# Altium schematic sheet Connectors.SchDoc
size A4; DocumentNumber: 1; SheetNumber: 1; SheetTotal: 8
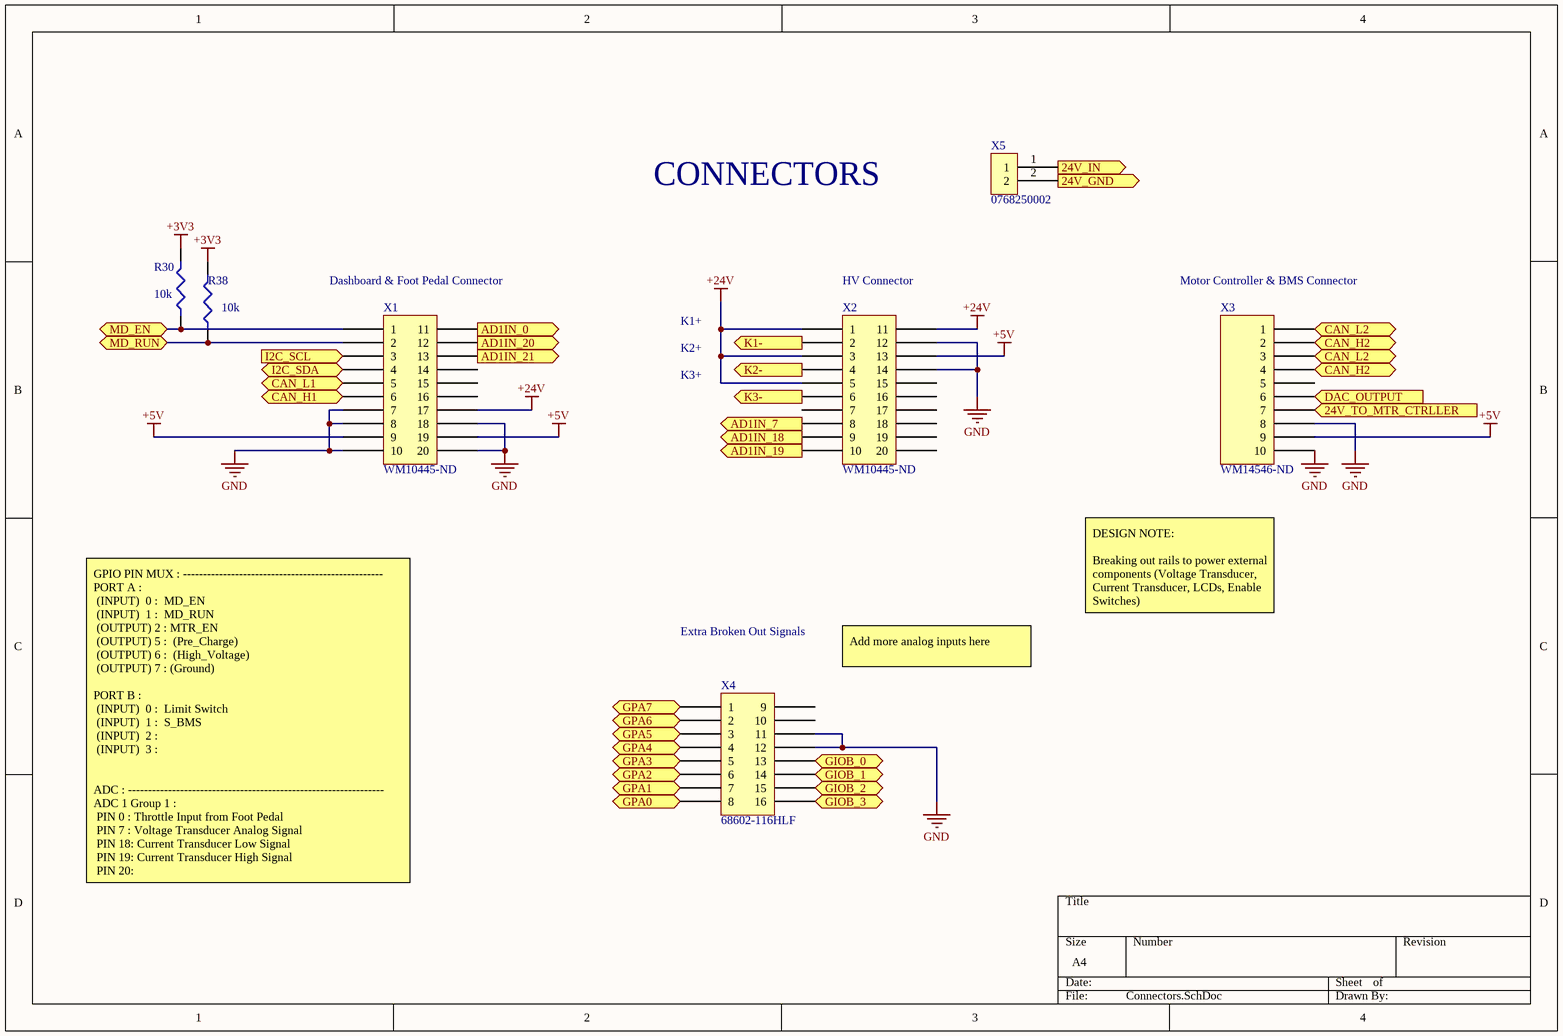
[diagram p0: Connectors.SchDoc]

## Parts
R30  10k  [R0805]
R38  10k  [R0805]
X1  WM10445-ND  [MOLEX_20pin]
X2  WM10445-ND  [MOLEX_20pin]
X3  WM14546-ND  [MOLEX_10PIN]
X4  68602-116HLF  [16PIN_HEADER]
X5  0768250002  [MOLEX_2PIN_MEGAFIT]

## Ports
24V_GND, 24V_IN, 24V_TO_MTR_CTRLLER, AD1IN_0, AD1IN_7, AD1IN_18, AD1IN_19, AD1IN_20, AD1IN_21, CAN_H1, CAN_H2, CAN_L1, CAN_L2, DAC_OUTPUT, GIOB_0, GIOB_1, GIOB_2, GIOB_3, GPA0, GPA1, GPA2, GPA3, GPA4, GPA5, GPA6, GPA7, I2C_SCL, I2C_SDA, K1-, K2-, K3-, MD_EN, MD_RUN

## Nets
+3V3: R30.2 R38.2
+5V: X1.9 X1.19 X2.13 X3.9
+24V: X1.17 X2.1 X2.3 X2.5 X2.11
GND: X1.7 X1.8 X1.10 X1.18 X1.20 X2.12 X2.14 X3.8 X3.10 X4.11 X4.12
24V_GND: X5.2 ; port 24V_GND
24V_IN: X5.1 ; port 24V_IN
24V_TO_MTR_CTRLLER: X3.7 ; port 24V_TO_MTR_CTRLLER
AD1IN_0: X1.11 ; port AD1IN_0
AD1IN_7: X2.8 ; port AD1IN_7
AD1IN_18: X2.9 ; port AD1IN_18
AD1IN_19: X2.10 ; port AD1IN_19
AD1IN_20: X1.12 ; port AD1IN_20
AD1IN_21: X1.13 ; port AD1IN_21
CAN_H1: X1.6 ; port CAN_H1
CAN_H2: X3.2 X3.4 ; port CAN_H2
CAN_L1: X1.5 ; port CAN_L1
CAN_L2: X3.1 X3.3 ; port CAN_L2
DAC_OUTPUT: X3.6 ; port DAC_OUTPUT
GIOB_0: X4.13 ; port GIOB_0
GIOB_1: X4.14 ; port GIOB_1
GIOB_2: X4.15 ; port GIOB_2
GIOB_3: X4.16 ; port GIOB_3
GPA0: X4.8 ; port GPA0
GPA1: X4.7 ; port GPA1
GPA2: X4.6 ; port GPA2
GPA3: X4.5 ; port GPA3
GPA4: X4.4 ; port GPA4
GPA5: X4.3 ; port GPA5
GPA6: X4.2 ; port GPA6
GPA7: X4.1 ; port GPA7
I2C_SCL: X1.3 ; port I2C_SCL
I2C_SDA: X1.4 ; port I2C_SDA
K1-: X2.2 ; port K1-
K2-: X2.4 ; port K2-
K3-: X2.6 ; port K3-
MD_EN: R30.1 X1.1 ; port MD_EN
MD_RUN: R38.1 X1.2 ; port MD_RUN

Not connected (* = marked no-connect by the designer): X1 14 15 16; X2 7 15 16 17 18 19 20; X3 5; X4 9 10

## Notes on the sheet
- CONNECTORS
- (near X1) Dashboard & Foot Pedal Connector
- (near X2) HV Connector
- (near X3) Motor Controller & BMS Connector
- K1+
- K2+
- K3+
- Extra Broken Out Signals
- DESIGN NOTE:
  Breaking out rails to power external components (Voltage Transducer, Current Transducer, LCDs, Enable Switches)
- Add more analog inputs here
- GPIO PIN MUX : --------------------------------------------------
  PORT A :
  (INPUT)		0 : 	MD_EN
  (INPUT)		1 : 	MD_RUN
  (OUTPUT)	2 :	MTR_EN
  (OUTPUT)	5 : 	(Pre_Charge)
  (OUTPUT)	6 : 	(High_Voltage)
  (OUTPUT)	7 :	(Ground)
  PORT B :
  (INPUT)		0 : 	Limit Switch
  (INPUT)		1 : 	S_BMS
  (INPUT)		2 :
  (INPUT)		3 :
  ADC : ----------------------------------------------------------------
  ADC 1 Group 1 :
  PIN 0 : Throttle Input from Foot Pedal
  PIN 7 : Voltage Transducer Analog Signal
  PIN 18: Current Transducer Low Signal
  PIN 19: Current Transducer High Signal
  PIN 20:

## Library data of the parts
R30 R38 = RC0805FR-071KL: RES SMD 10K OHM 1% 1/8W 0805; Manufacturer: Yageo Phycomp; Temperature Coefficient: 100ppm/°C; Resistance: 1KR; Voltage Rating (DC): 150V; Power Rating: 125mW; Supplier 1: Digi-Key; Manufacturer Part Number: RC0805FR-071KL; Stock 1: 5527973; Pricing 1: 1=0.1, 10=0.022, 100=0.0088, 1000=0.004, 2500=0.0034 (USD); Case/Package: 0805; Number of Pins: 2; Min Operating Temperature: -55°C; Max Operating Temperature: 155°C; Tolerance: 1%; Packaging: Cut Tape; Length: 2mm; Height: 0.5mm; Width: 1.25mm; Depth: 1.25mm; REACH SVHC: No SVHC; Lead Free: Lead Free
X1 X2 = 0346916200: CONN_20Positions Molex Stac64 Header, Shrouded Connector 0.100" (2.54mm) Through Hole, Right Angle Tin; Number of Positions: 20; Connector Type: Male Pin; Pitch: 0.1inch; Supplier 1: Digi-Key; Manufacturer: Molex; Manufacturer Part Number: 0346916200; Stock 1: 334; Pricing 1: 1=3.07, 10=2.946, 100=2.4546, 500=2.0864, 1000=1.7796, 5000=1.5955 (USD); Case/Package: 100; Colour: Black; Contact Plating: Tin; Package Quantity: 560; Packaging: Tray; Number of Rows: 2; Termination: Solder; Row Spacing: 0.1inch; ComponentLink1URL: https://datasheet.ciiva.com/29142/987651-0141-29142848.pdf; ComponentLink1Description: https://datasheet.ciiva.com/29142/987651-0141-29142848.pdf; Supplier Part Number 1: WM10445-ND
X3 = 0346960101: CONN_10Positions Molex Stac64 Thru-Hole Tray; Number of Positions: 10; Gender: Male; Connector Type: Male Pin; Row Spacing: 0.248inch; Pitch: 2.54mm; Supplier 1: Digi-Key; Manufacturer: Molex; Manufacturer Part Number: 0346960101; Stock 1: 1144; Pricing 1: 1=2.65, 10=2.54, 100=2.1164, 500=1.7989, 1000=1.5344, 5000=1.3757 (USD); Mount: Through Hole; Colour: Grey; Contact Plating: Tin; Contact Material: Copper; Housing Colour: Natural; Housing Material: Thermoplastic; Min Operating Temperature: -40°C; Max Operating Temperature: 100°C; Package Quantity: 560; Number of Rows: 2; Fastening Type: Latch; Packaging: Tray; Termination: Solder; Number of Contacts: 10; Orientation: Right Angle; Length: 34.04mm; ComponentLink1URL: https://datasheet.ciiva.com/6844/346960101-sd-6844161.pdf; ComponentLink1Description: https://datasheet.ciiva.com/6844/346960101-sd-6844161.pdf; ComponentLink2URL: https://datasheet.ciiva.com/10081/0346960101-pcb-headers-10081642.pdf; ComponentLink2Description: https://datasheet.ciiva.com/10081/0346960101-pcb-headers-10081642.pdf; Supplier Part Number 1: WM14546-ND
X4 = 68602-116HLF: CONN_HeaderPins16pos1  6 Positions Header, Unshrouded Connector 0.100" (2.54mm) Through Hole Gold or Gold, GXT™; Manufacturer: Amphenol FCI; Current Rating: 3A; Voltage Rating: 1.5kV; Number of Positions: 16; Gender: Male; Connector Type: Male Pin; Insulation Resistance: 5GR; Row Spacing: 0.1inch; Mating Post Length: 5.84mm; Supplier 1: Digi-Key; Manufacturer Part Number: 68602-116HLF; Stock 1: 1898; Pricing 1: 1=0.79, 10=0.698, 100=0.6019, 500=0.4925, 1000=0.4378, 5000=0.383, 10000=0.3639 (USD); Mount: Through Hole; Contact Plating: Nickel,Gold,GXT; Contact Material: Bronze; Colour: Black; Housing Colour: Black; Housing Material: Thermoplastic; Min Operating Temperature: -65°C; Max Operating Temperature: 125°C; Number of Rows: 2; Packaging: Bulk; Package Quantity: 100; Termination: Solder; Max Voltage Rating (AC): 1.5kV; Number of Contacts: 16; Orientation: Straight; Contact Gender: Male; Length: 20.32mm; Pitch: 2.54mm; Depth: 4.83mm; Contact Mating Length: 0.23inch; Termination Post Length: 3.81mm; Radiation Hardening: No; REACH SVHC: No SVHC; Flammability Rating: UL94 V-0; ComponentLink1URL: https://datasheet.ciiva.com/16726/67996-16726040.pdf; ComponentLink1Description: https://datasheet.ciiva.com/16726/67996-16726040.pdf; ComponentLink2URL: https://datasheet.ciiva.com/9465/67996-9465931.pdf; ComponentLink2Description: https://datasheet.ciiva.com/9465/67996-9465931.pdf; ComponentLink3URL: https://datasheet.ciiva.com/728/67996-728940.pdf; ComponentLink3Description: https://datasheet.ciiva.com/728/67996-728940.pdf; ComponentLink4URL: https://datasheet.ciiva.com/5157/67996-225486-5157197.pdf; ComponentLink4Description: https://datasheet.ciiva.com/5157/67996-225486-5157197.pdf; Supplier Part Number 1: 609-3364-ND
X5 = 0768250002: CONN_2Position_MEGAFIT Molex Through Hole, Right Angle Tin; Number of Positions: 2; Connector Type: Male Pin; Row Spacing: 0.224inch; Supplier 1: Digi-Key; Manufacturer: Molex; Manufacturer Part Number: 0768250002; Stock 1: 2862; Pricing 1: 1=1.08, 10=0.946, 25=0.89, 50=0.853, 100=0.816, 250=0.7418, 500=0.6676, 1000=0.5934, 2500=0.5378 (USD); Mount: Through Hole; Colour: Black; Contact Plating: Tin; Packaging: Tray; Number of Rows: 2; Termination: Solder; Fastening Type: Ramp; ComponentLink1URL: http://www.molex.com/pdm_docs/ps/PS-76823-100.pdf; ComponentLink1Description: http://www.molex.com/pdm_docs/ps/PS-76823-100.pdf; Supplier Part Number 1: WM11969-ND